# Altium project 48-24V PDB.PrjPcb
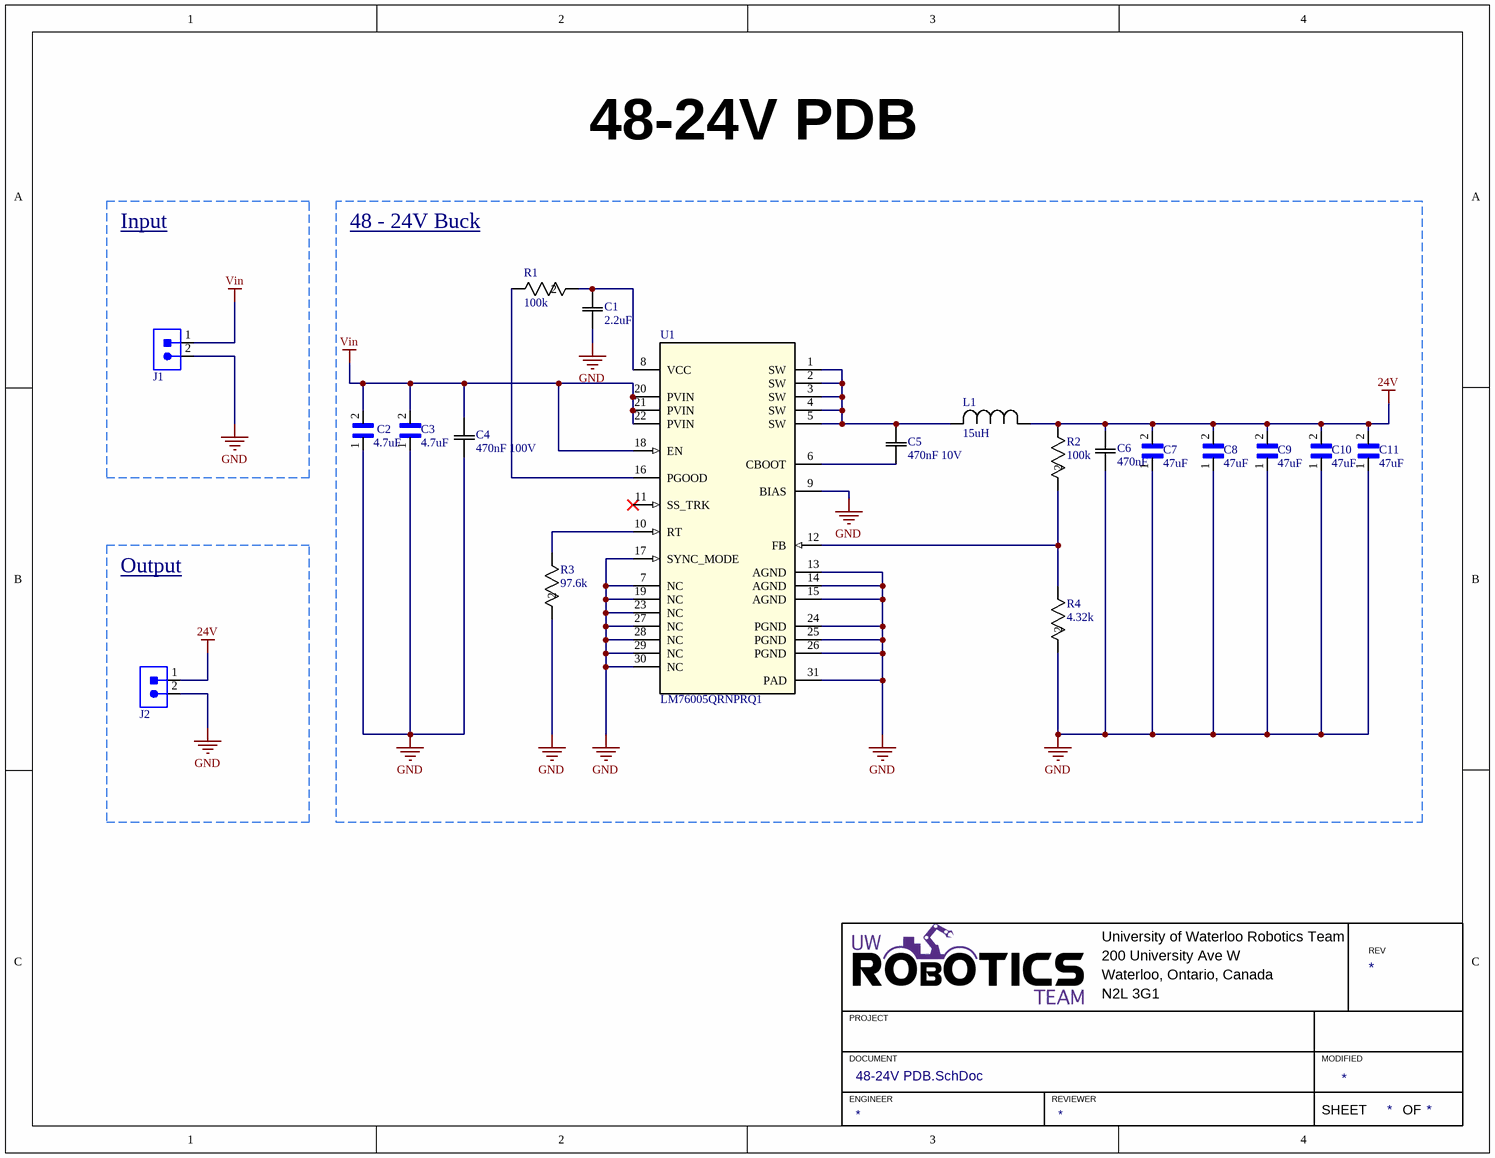
[diagram p0: 48-24V PDB.SchDoc]
designer: Logan Hartford; reviewer: Ari Wasch; total sheets: 6; version: 6.0
1 sheet, 19 parts. Net scope: global (net labels, ports and power ports of the same name join across sheets).

## Sheet 48-24V PDB.SchDoc: 48-24V PDB
size 279 x 215 mm

### Parts
C1  2.2uF  [CAP_1608_TDK]
C2  4.7uF  [CAPC3216X190N]
C3  4.7uF  [CAPC3216X190N]
C4  470nF 100V  [CAP_2012_TDK]
C5  470nF 10V  [G-155_MUR]
C6  470nF  [CAP_1608_TDK]
C7  47uF  [CAPC6050X550N]
C8  47uF  [CAPC6050X550N]
C9  47uF  [CAPC6050X550N]
C10  47uF  [CAPC6050X550N]
C11  47uF  [CAPC6050X550N]
J1  CON_2POS_SCREW_TERM  [VP0265840000G]  (value not drawn)
J2  CON_2POS_SCREW_TERM  [VP0265840000G]  (value not drawn)
L1  15uH  [IND_1890_2-WE-HCI_WRE]
R1  100k  [RES_CRCW_0402_VIS]
R2  100k  [RES_CRCW_0402_VIS]
R3  97.6k  [RC0402N_VIS]
R4  4.32k  [RC0603N_VIS]
U1  LM76005QRNPRQ1  [RNP0030A]

### Blocks framed on the sheet
Input: J1
48 - 24V Buck: C1-C11 L1 R1-R4 U1
Output: J2

### Nets
24V: C6.2 C7.2 C8.2 C9.2 C10.2 C11.2 J2.1 L1.1 R2.1
GND: C1.1 C2.1 C3.1 C4.1 C6.1 C7.1 C8.1 C9.1 C10.1 C11.1 J1.2 J2.2 R3.2 R4.2 U1.7(NC) U1.9(BIAS) U1.13(AGND) U1.14(AGND) U1.15(AGND) U1.17(SYNC_MODE) U1.19(NC) U1.23(NC) U1.24(PGND) U1.25(PGND) U1.26(PGND) U1.27(NC) U1.28(NC) U1.29(NC) U1.30(NC) U1.31(PAD)
Vin: C2.2 C3.2 C4.2 J1.1 U1.18(EN) U1.20(PVIN) U1.21(PVIN) U1.22(PVIN)
NetC1_2: C1.2 R1.2 U1.8(VCC)
NetC5_1: C5.1 U1.6(CBOOT)
NetC5_2: C5.2 L1.2 U1.1(SW) U1.2(SW) U1.3(SW) U1.4(SW) U1.5(SW)
NetR1_1: R1.1 U1.16(PGOOD)
NetR2_2: R2.2 R4.1 U1.12(FB)
NetR3_1: R3.1 U1.10(RT)

Not connected (* = marked no-connect by the designer): U1 11(SS_TRK)*

### Notes on the sheet
- University of Waterloo Robotics Team
- 200 University Ave W
- REV
- PROJECT
- Waterloo, Ontario, Canada
- N2L 3G1
- DOCUMENT
- ENGINEER
- REVIEWER
- MODIFIED
- SHEET
- OF

### Library data of the parts
C1 = C1608X6S1C225K080AC: No Description Available; Mfr_Name: TDK; Digi-Key_Part_Number_3: 445-7438-6-ND; Digi-Key_Part_Number_2: 445-7438-2-ND; Digi-Key_Part_Number_1: 445-7438-1-ND
C2 C3 = GRM31CC72A475ME11L: SMD Capacitor X7S(EIA) with Capacitance: 4.7uF Tol. 20%. Rated Voltage: 100Vdc; Package: None; Price: None; Value: *; MP: GRM31CC72A475ME11L; Availability: Unavailable
C4 = C2012X7S2A474K125AB: No Description Available; Mfr_Name: TDK; Digi-Key_Part_Number_3: 445-5203-6-ND; Digi-Key_Part_Number_2: 445-5203-2-ND; Digi-Key_Part_Number_1: 445-5203-1-ND
C5 = GRM155R61A474KE15D: No Description Available; Mfr_Name: Murata; Digi-Key_Part_Number_3: 490-3264-6-ND; Digi-Key_Part_Number_2: 490-3264-2-ND; Digi-Key_Part_Number_1: 490-3264-1-ND
C6 = C1608X7R1H474K080AC: No Description Available; Mfr_Name: TDK; Digi-Key_Part_Number_4: 445-5952-6-ND; Digi-Key_Part_Number_3: 445-5952-2-NDL; Digi-Key_Part_Number_1: 445-5952-1-ND; Digi-Key_Part_Number_2: 445-5952-2-ND
C7-C11 = CKG57NX7R1H476M500JH: 47 µF ±20% 50V Ceramic Capacitor X7R Stacked SMD, 2 J-Lead; MF: TDK Corporation; SnapEDA_Link: https://www.snapeda.com/parts/CKG57NX7R1H476M500JH/TDK/view-part/?ref=snap; Price: None; Purchase-URL: https://pricing.snapeda.com/search/part/CKG57NX7R1H476M500JH/?ref=eda; Value: *; MP: CKG57NX7R1H476M500JH; Availability: In Stock; Check_prices: https://www.snapeda.com/parts/CKG57NX7R1H476M500JH/TDK/view-part/?ref=eda; Package: 6050 TDK
J1 J2 = CON_2POS_SCREW_TERM_65A: PCB TERMINAL BLOCKS RISING CLAMP; Manufacturer 1: Amphenol Anytek; Supplier 1: Digi-Key; Mounting Type: TH; Package/Footprint: TERMINAL; Supplier Part Number 1: 1818-VP0265840000G-ND; Manufacturer Part Number 1: VP0265840000G
L1 = 74435571500: No Description Available; Mfr_Name: Wurth Electronics; Digi-Key_Part_Number_3: 732-2176-6-ND; Digi-Key_Part_Number_2: 732-2176-1-ND; Digi-Key_Part_Number_1: 732-2176-2-ND
R1 R2 = CRCW0402100KFKED: No Description Available; Mfr_Name: Vishay; Digi-Key_Part_Number_4: 541-100KLTR-NDL; Digi-Key_Part_Number_3: 541-100KLTR-ND; Digi-Key_Part_Number_1: 541-100KLCT-ND; Digi-Key_Part_Number_2: 541-100KLDKR-ND
R3 = CRCW040297K6FKED: No Description Available; Mfr_Name: Vishay; Digi-Key_Part_Number_3: 541-97.6KLTR-ND; Digi-Key_Part_Number_2: 541-97.6KLDKR-ND; Digi-Key_Part_Number_1: 541-97.6KLCT-ND
R4 = CRCW06034K32FKEA: No Description Available; Mfr_Name: Vishay; Digi-Key_Part_Number_3: 541-4.32KHTR-ND; Digi-Key_Part_Number_2: 541-4.32KHDKR-ND; Digi-Key_Part_Number_1: 541-4.32KHCT-ND
U1 = LM76005QRNPRQ1: No Description Available; Mfr_Name: Texas Instruments; TYPE: TYPE; RefDes: RefDes; Digi-Key_Part_Number_3: 296-LM76005QRNPRQ1TR-ND; Digi-Key_Part_Number_2: 296-LM76005QRNPRQ1DKR-ND

## Assembly variants
Only Populated Components: not fitted R28 R31 R44 R47 R60 R77